# Altium schematic sheet Mezzanine.SchDoc: Mezzanine Interface
size Letter; Author: Norman Chong; Organization: Midnight Sun Solar Rayce Car Team; Address1: University of Waterloo; Address2: 200 University Ave W; Address3: Waterloo, ON, Canada; Address4: N2L 3E9; Revision: 1.11; SheetNumber: 2; SheetTotal: 2; Website: www.uwmidsun.com; ProjectAuthor: Norman Chong; ProjectRevision: 1.13
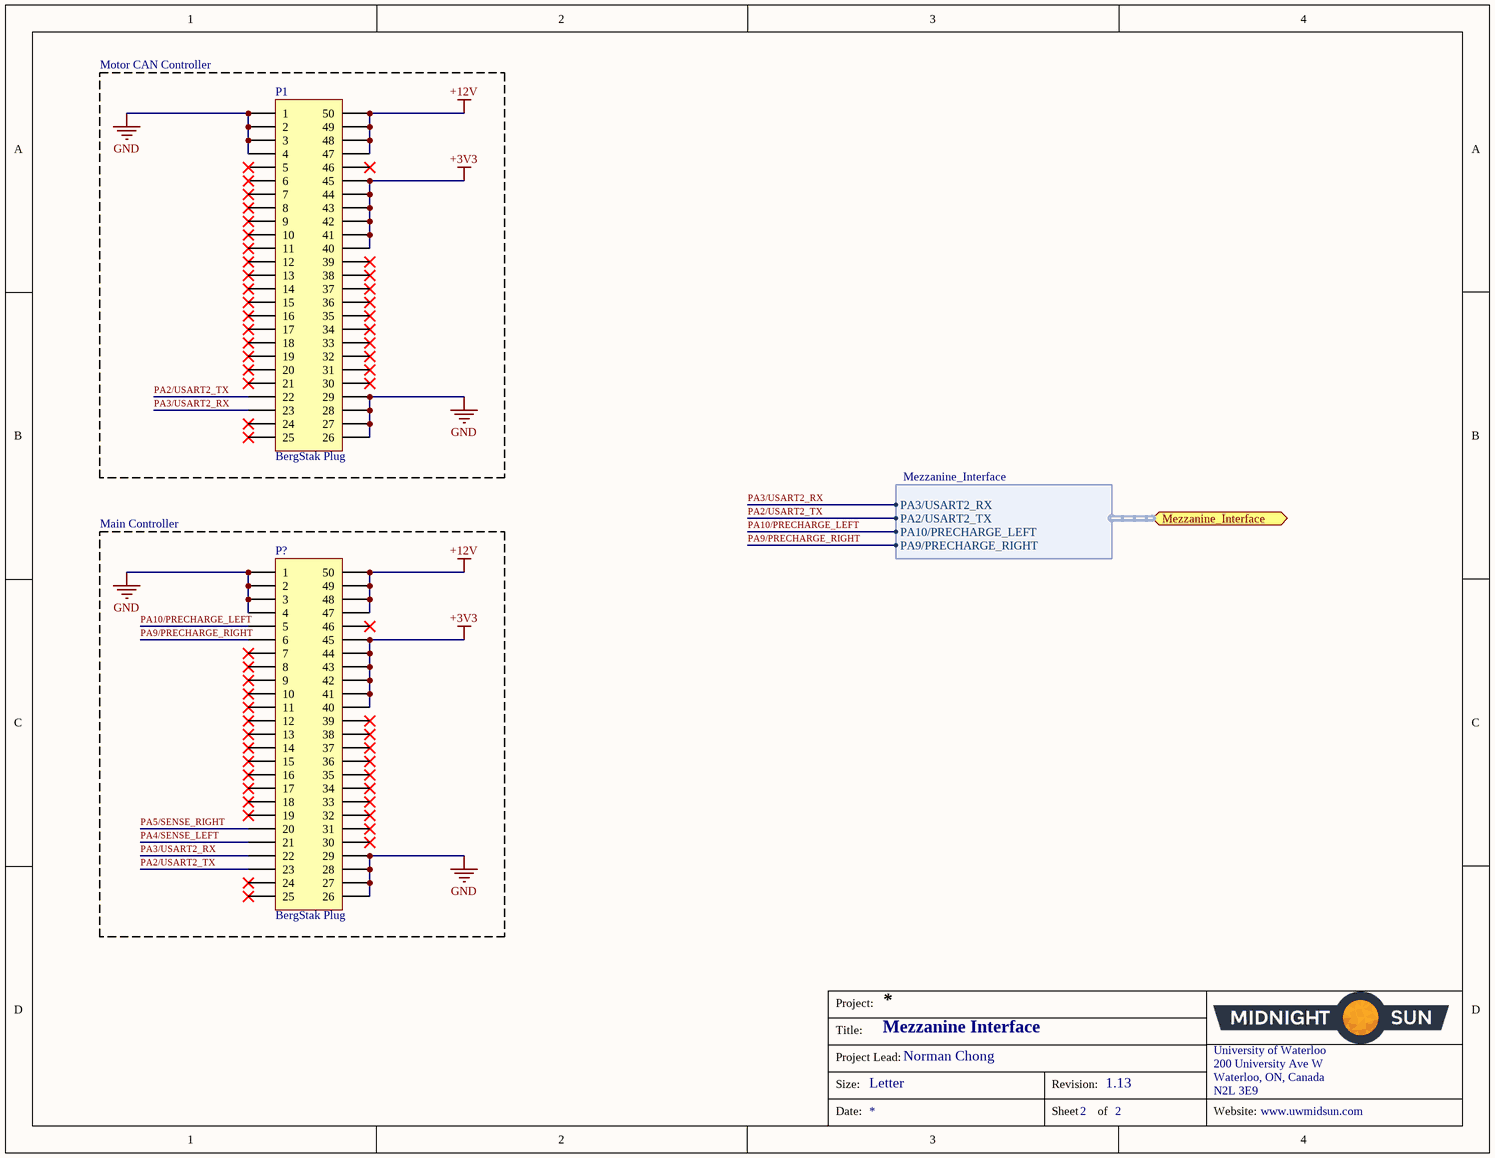
[diagram p0: Mezzanine.SchDoc]

## Parts
P1  Series: BergStak Plug  [CONN, Bergstak 50 Pos Plug]  (hidden comment: CONN 50POS Bergstak Plug 0.02")
P?  Series: BergStak Plug  [CONN, Bergstak 50 Pos Plug]  (hidden comment: CONN 50POS Bergstak Plug 0.02")

## Blocks framed on the sheet
Motor CAN Controller: P1
Main Controller: P?

## Ports
Mezzanine_Interface (harness Mezzanine_Interface)

## Harnesses
Mezzanine_Interface: PA3/USART2_RX, PA2/USART2_TX, PA10/PRECHARGE_LEFT, PA9/PRECHARGE_RIGHT

## Nets
+3V3: P1.40 P1.41 P1.42 P1.43 P1.44 P1.45 P?.40 P?.41 P?.42 P?.43 P?.44 P?.45
+12V: P1.47 P1.48 P1.49 P1.50 P?.47 P?.48 P?.49 P?.50
GND: P1.1 P1.2 P1.3 P1.4 P1.26 P1.27 P1.28 P1.29 P?.1 P?.2 P?.3 P?.4 P?.26 P?.27 P?.28 P?.29
PA2/USART2_TX: P1.22 P?.23 ; port Mezzanine_Interface.PA2/USART2_TX
PA3/USART2_RX: P1.23 P?.22 ; port Mezzanine_Interface.PA3/USART2_RX
PA4/SENSE_LEFT: P?.21
PA5/SENSE_RIGHT: P?.20
PA9/PRECHARGE_RIGHT: P?.6 ; port Mezzanine_Interface.PA9/PRECHARGE_RIGHT
PA10/PRECHARGE_LEFT: P?.5 ; port Mezzanine_Interface.PA10/PRECHARGE_LEFT

Not connected (* = marked no-connect by the designer): P1 5* 6* 7* 8* 9* 10* 11* 12* 13* 14* 15* 16* 17* 18* 19* 20* 21* 24* 25* 30* 31* 32* 33* 34* 35* 36* 37* 38* 39* 46*; P? 7* 8* 9* 10* 11* 12* 13* 14* 15* 16* 17* 18* 19* 24* 25* 30* 31* 32* 33* 34* 35* 36* 37* 38* 39* 46*

## Notes on the sheet
- Project:
- Title:
- Size:
- Project Lead:
- Letter
- Revision:
- University of Waterloo
- 200 University Ave W
- Waterloo, ON, Canada
- N2L 3E9
- Date:
- Sheet
- of
- Website:

## Library data of the parts
P1 P? = CONN 50POS Bergstak Plug 0.02": 50 Position Connector Plug, Outer Shroud Contacts Surface Mount Gold; Manufacturer 1: Amphenol FCI; Manufacturer Part Number 1: 10132797-055100LF; Number of Positions: 50; Mated Stacking Heights: 5mm; Pitch: 0.020" (0.50mm); Supplier 1: Digi-Key; Supplier Part Number 1: 609-5226-1-ND; Packaging: Cut Tape (CT); Part Status: Active; Connector Type: Plug, Outer Shroud Contacts; Number of Rows: 2; Mounting Type: Surface Mount; Contact Finish: Gold; Contact Finish Thickness: 1µin (0.025µm); Height Above Board: 0.169" (4.30mm); ComponentLink1URL: http://portal.fciconnect.com/Comergent//fci/drawing/10132797.pdf; ComponentLink1Description: http://portal.fciconnect.com/Comergent//fci/drawing/10132797.pdf